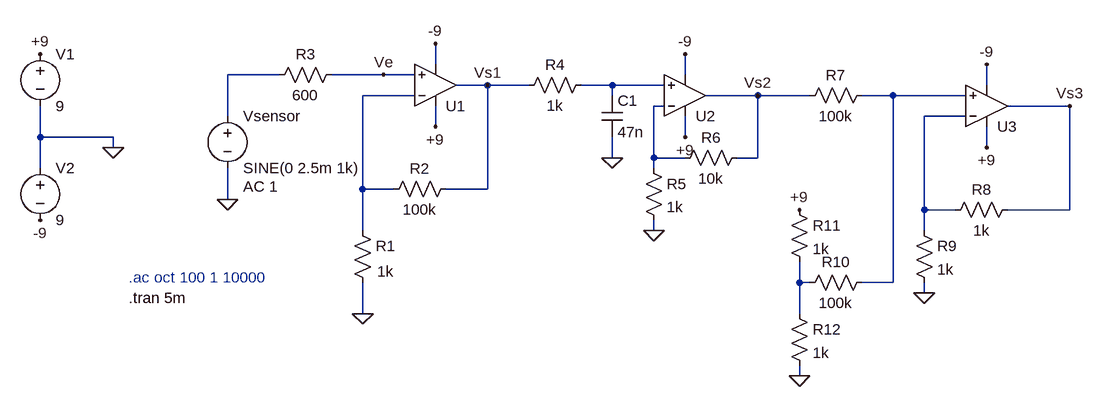
[diagram p0: schematic Lab1_parte1c.asc]
Lab1_parte1c.asc, the LTspice schematic file:
Version 4
SHEET 1 1368 680
WIRE 352 176 352 144
WIRE 112 192 32 192
WIRE 272 192 192 192
WIRE 320 192 272 192
WIRE 736 192 736 160
WIRE 432 208 384 208
WIRE 496 208 432 208
WIRE 624 208 576 208
WIRE 704 208 624 208
WIRE 1200 208 1200 176
WIRE 320 224 240 224
WIRE 624 224 624 208
WIRE 848 224 768 224
WIRE 928 224 848 224
WIRE 1056 224 1008 224
WIRE 1168 224 1056 224
WIRE 704 240 688 240
WIRE 1328 240 1232 240
WIRE 32 256 32 192
WIRE 1168 256 1104 256
WIRE 352 272 352 240
WIRE -256 288 -256 240
WIRE -144 288 -256 288
WIRE 736 288 736 256
WIRE -144 304 -144 288
WIRE 1200 304 1200 272
WIRE 624 320 624 288
WIRE 688 320 688 240
WIRE 736 320 688 320
WIRE 848 320 848 224
WIRE 848 320 816 320
WIRE -256 336 -256 288
WIRE 688 336 688 320
WIRE 240 368 240 224
WIRE 288 368 240 368
WIRE 432 368 432 208
WIRE 432 368 368 368
WIRE 32 384 32 336
WIRE 1104 400 1104 256
WIRE 1152 400 1104 400
WIRE 1328 400 1328 240
WIRE 1328 400 1232 400
WIRE 240 432 240 368
WIRE 688 432 688 416
WIRE 1104 432 1104 400
WIRE 912 512 912 480
WIRE 928 512 912 512
WIRE 1056 512 1056 224
WIRE 1056 512 1008 512
WIRE 1104 528 1104 512
WIRE 240 560 240 512
WIRE 912 560 912 512
WIRE 912 656 912 640
FLAG -144 304 0
FLAG -256 160 +9
FLAG -256 416 -9
FLAG 352 144 -9
FLAG 352 272 +9
FLAG 240 560 0
FLAG 32 384 0
FLAG 272 192 Ve
FLAG 432 208 Vs1
FLAG 688 432 0
FLAG 736 288 +9
FLAG 624 320 0
FLAG 736 160 -9
FLAG 848 224 Vs2
FLAG 1200 176 -9
FLAG 1200 304 +9
FLAG 1104 528 0
FLAG 912 400 +9
FLAG 912 656 0
FLAG 1328 240 Vs3
SYMBOL voltage -256 144 R0
WINDOW 123 0 0 Left 0
WINDOW 39 0 0 Left 0
SYMATTR InstName V1
SYMATTR Value 9
SYMBOL voltage -256 320 R0
WINDOW 123 0 0 Left 0
WINDOW 39 0 0 Left 0
SYMATTR InstName V2
SYMATTR Value 9
SYMBOL OpAmps\\UniversalOpAmp 352 208 M180
SYMATTR InstName U1
SYMATTR Value2 Avol=1Meg GBW=1Meg Vos=0
SYMBOL res 224 416 R0
WINDOW 3 38 79 Left 2
SYMATTR Value 1k
SYMATTR InstName R1
SYMBOL res 384 352 R90
WINDOW 0 0 56 VBottom 2
WINDOW 3 32 56 VTop 2
SYMATTR InstName R2
SYMATTR Value 100k
SYMBOL res 96 208 R270
WINDOW 0 32 56 VTop 2
WINDOW 3 0 56 VBottom 2
SYMATTR InstName R3
SYMATTR Value 600
SYMBOL voltage 32 240 R0
WINDOW 123 24 124 Left 2
WINDOW 39 0 0 Left 0
SYMATTR Value2 AC 1
SYMATTR InstName Vsensor
SYMATTR Value SINE(0 2.5m 1k)
SYMBOL res 592 192 R90
WINDOW 0 0 56 VBottom 2
WINDOW 3 32 56 VTop 2
SYMATTR InstName R4
SYMATTR Value 1k
SYMBOL OpAmps\\UniversalOpAmp 736 224 M180
SYMATTR InstName U2
SYMBOL cap 608 224 R0
SYMATTR InstName C1
SYMATTR Value 47n
SYMBOL res 672 320 R0
SYMATTR InstName R5
SYMATTR Value 1k
SYMBOL res 832 304 R90
WINDOW 0 0 56 VBottom 2
WINDOW 3 32 56 VTop 2
SYMATTR InstName R6
SYMATTR Value 10k
SYMBOL OpAmps\\UniversalOpAmp 1200 240 M180
SYMATTR InstName U3
SYMBOL res 1024 208 R90
WINDOW 0 0 56 VBottom 2
WINDOW 3 32 56 VTop 2
SYMATTR InstName R7
SYMATTR Value 100k
SYMBOL res 1248 384 R90
WINDOW 0 0 56 VBottom 2
WINDOW 3 32 56 VTop 2
SYMATTR InstName R8
SYMATTR Value 1k
SYMBOL res 1088 416 R0
SYMATTR InstName R9
SYMATTR Value 1k
SYMBOL res 1024 496 R90
WINDOW 0 0 56 VBottom 2
WINDOW 3 32 56 VTop 2
SYMATTR InstName R10
SYMATTR Value 100k
SYMBOL res 896 384 R0
SYMATTR InstName R11
SYMATTR Value 1k
SYMBOL res 896 544 R0
SYMATTR InstName R12
SYMATTR Value 1k
TEXT -120 504 Left 2 ;.ac oct 100 1 10000
TEXT -120 536 Left 2 !.tran 5m

The netlist it stands for:
* Lab1_parte1c.asc
V1 +9 0 9
V2 0 -9 9
XU1 Ve N003 +9 -9 Vs1 level1 Avol=1Meg GBW=1Meg Vos=0 En=0 Enk=0 In=0 Ink=0 Rin=500Meg  ; pins In+ In- V+ V- OUT
R1 N003 0 1k
R2 Vs1 N003 100k
R3 N001 Ve 600
Vsensor N001 0 SINE(0 2.5m 1k) AC 1
R4 N002 Vs1 1k
XU2 N002 N005 +9 -9 Vs2 level1 Avol=1Meg GBW=10Meg Vos=0 En=0 Enk=0 In=0 Ink=0 Rin=500Meg  ; pins In+ In- V+ V- OUT
C1 N002 0 47n
R5 N005 0 1k
R6 Vs2 N005 10k
XU3 N004 N006 +9 -9 Vs3 level1 Avol=1Meg GBW=10Meg Vos=0 En=0 Enk=0 In=0 Ink=0 Rin=500Meg  ; pins In+ In- V+ V- OUT
R7 N004 Vs2 100k
R8 Vs3 N006 1k
R9 N006 0 1k
R10 N004 N007 100k
R11 +9 N007 1k
R12 N007 0 1k
* .ac oct 100 1 10000
.tran 5m
.lib UniversalOpAmp1.lib
.backanno
.end